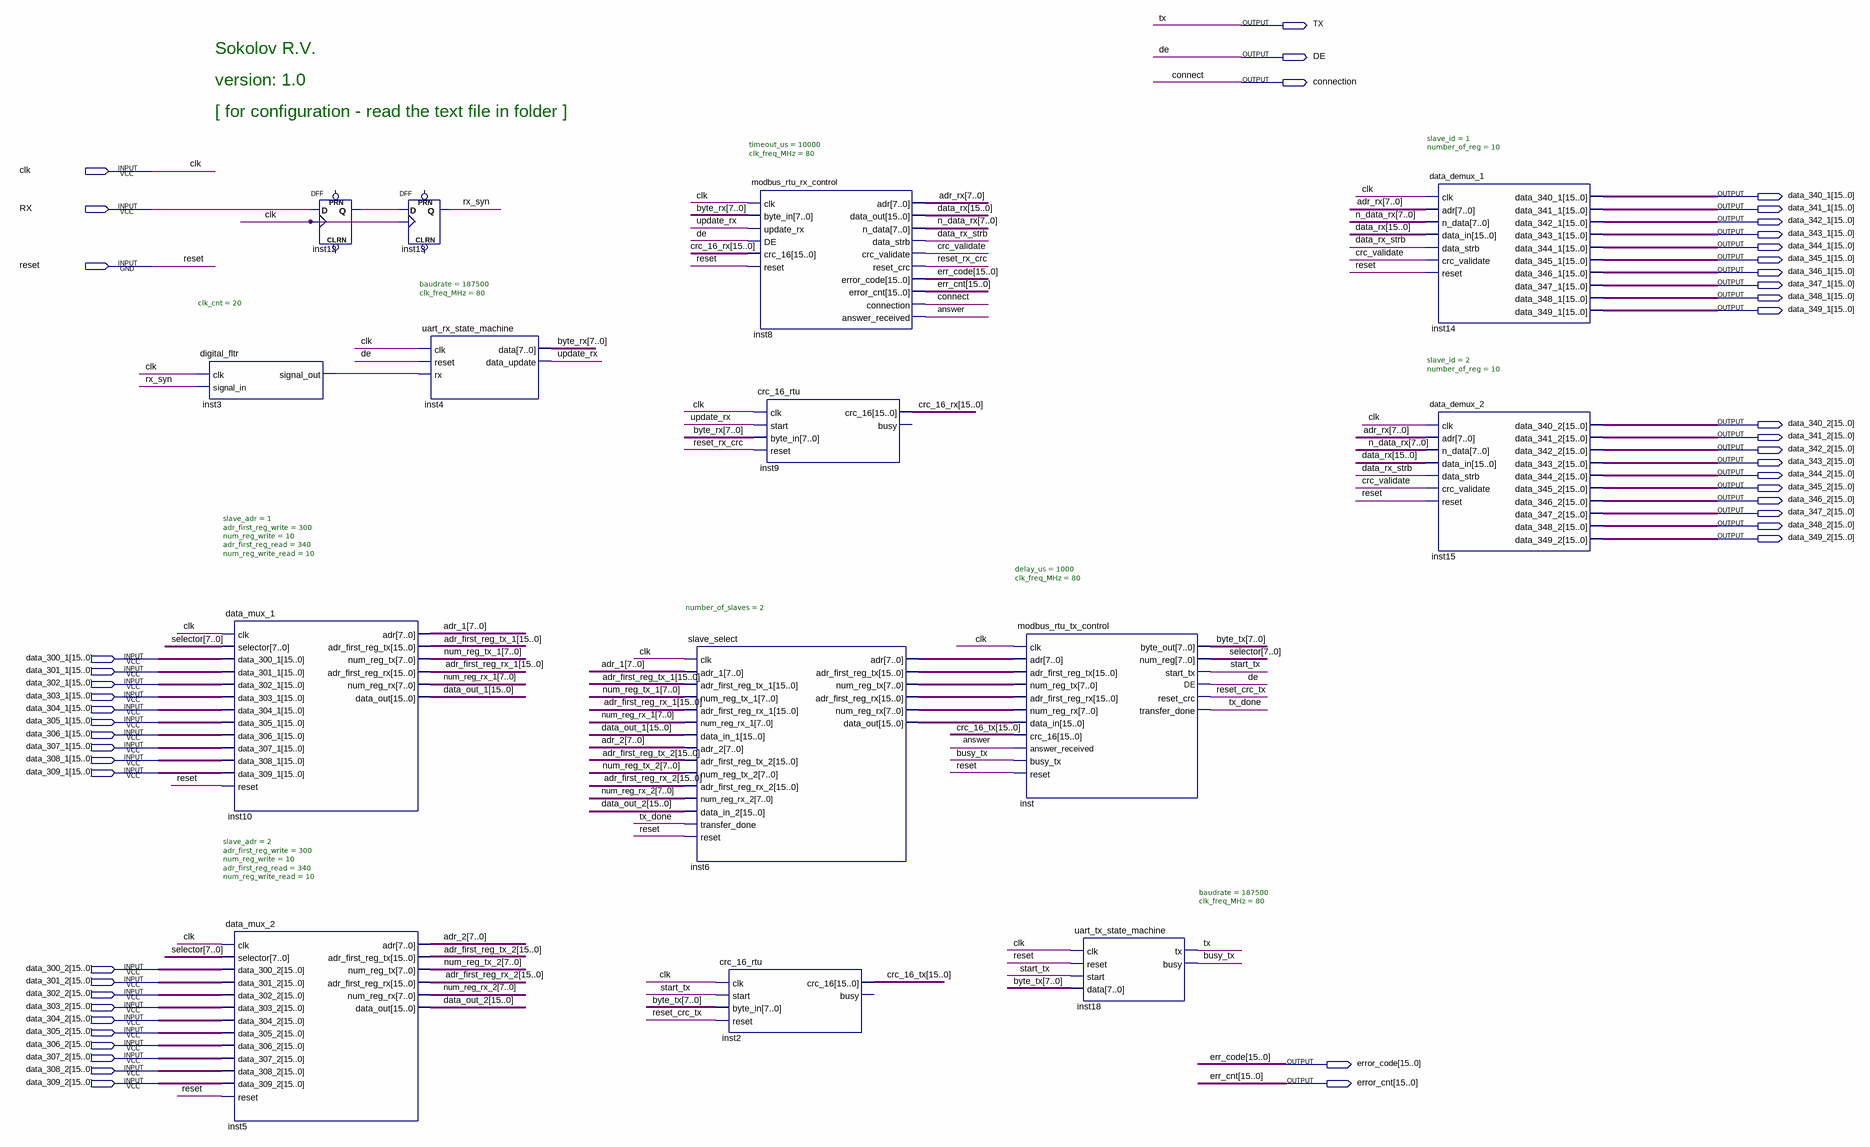
[diagram p0: schematic sheet]
// Quartus schematic Modbus_RTU_Master_v1.bdf as structural Verilog: 14 symbols, 48 pins
module Modbus_RTU_Master_v1 (
  input  clk,
  input  RX,
  input  reset,
  input  [15:0] data_300_1,
  input  [15:0] data_301_1,
  input  [15:0] data_302_1,
  input  [15:0] data_303_1,
  input  [15:0] data_304_1,
  input  [15:0] data_305_1,
  input  [15:0] data_306_1,
  input  [15:0] data_307_1,
  input  [15:0] data_308_1,
  input  [15:0] data_309_1,
  input  [15:0] data_300_2,
  input  [15:0] data_301_2,
  input  [15:0] data_302_2,
  input  [15:0] data_303_2,
  input  [15:0] data_304_2,
  input  [15:0] data_305_2,
  input  [15:0] data_306_2,
  input  [15:0] data_307_2,
  input  [15:0] data_308_2,
  input  [15:0] data_309_2,
  output TX,
  output DE,
  output connection,
  output [15:0] data_340_1,
  output [15:0] data_341_1,
  output [15:0] data_342_1,
  output [15:0] data_343_1,
  output [15:0] data_344_1,
  output [15:0] data_345_1,
  output [15:0] data_346_1,
  output [15:0] data_347_1,
  output [15:0] data_348_1,
  output [15:0] data_349_1,
  output [15:0] data_340_2,
  output [15:0] data_341_2,
  output [15:0] data_342_2,
  output [15:0] data_343_2,
  output [15:0] data_344_2,
  output [15:0] data_345_2,
  output [15:0] data_346_2,
  output [15:0] data_347_2,
  output [15:0] data_348_2,
  output [15:0] data_349_2,
  output [15:0] error_code,
  output [15:0] error_cnt
);

  wire answer, busy_tx, crc_validate, data_rx_strb, inst3_signal_out, inst12_q, reset_crc_tx, reset_rx_crc,
       rx_syn, start_tx, tx_done, update_rx;
  wire [7:0] adr_1, adr_2, adr_rx, byte_rx, byte_tx, inst6_adr, inst6_num_reg_rx, inst6_num_reg_tx,
       n_data_rx, num_reg_rx_1, num_reg_rx_2, num_reg_tx_1, num_reg_tx_2, selector;
  wire [15:0] adr_first_reg_rx_1, adr_first_reg_rx_2, adr_first_reg_tx_1, adr_first_reg_tx_2, crc_16_rx,
       crc_16_tx, data_out_1, data_out_2, data_rx, inst6_adr_first_reg_rx, inst6_adr_first_reg_tx,
       inst6_data_out;

  digital_fltr #(.clk_cnt(20)) inst3 (.clk(clk), .signal_in(rx_syn), .signal_out(inst3_signal_out));
  data_mux_1 #(.slave_adr(1), .adr_first_reg_write(300), .num_reg_write(10), .adr_first_reg_read(340), .num_reg_write_read(10)) inst10 (
    .clk(clk), .selector(selector), .data_300_1(data_300_1), .data_301_1(data_301_1),
    .data_302_1(data_302_1), .data_303_1(data_303_1), .data_304_1(data_304_1), .data_305_1(data_305_1),
    .data_306_1(data_306_1), .data_307_1(data_307_1), .data_308_1(data_308_1), .data_309_1(data_309_1),
    .reset(reset), .adr(adr_1), .adr_first_reg_tx(adr_first_reg_tx_1), .num_reg_tx(num_reg_tx_1),
    .adr_first_reg_rx(adr_first_reg_rx_1), .num_reg_rx(num_reg_rx_1), .data_out(data_out_1));
  data_mux_2 #(.slave_adr(2), .adr_first_reg_write(300), .num_reg_write(10), .adr_first_reg_read(340), .num_reg_write_read(10)) inst5 (
    .clk(clk), .selector(selector), .data_300_2(data_300_2), .data_301_2(data_301_2),
    .data_302_2(data_302_2), .data_303_2(data_303_2), .data_304_2(data_304_2), .data_305_2(data_305_2),
    .data_306_2(data_306_2), .data_307_2(data_307_2), .data_308_2(data_308_2), .data_309_2(data_309_2),
    .reset(reset), .adr(adr_2), .adr_first_reg_tx(adr_first_reg_tx_2), .num_reg_tx(num_reg_tx_2),
    .adr_first_reg_rx(adr_first_reg_rx_2), .num_reg_rx(num_reg_rx_2), .data_out(data_out_2));
  DFF inst12 (.CLK(clk), .D(RX), .Q(inst12_q));  // open: CLRN, PRN
  DFF inst13 (.CLK(clk), .D(inst12_q), .Q(rx_syn));  // open: CLRN, PRN
  uart_rx_state_machine #(.baudrate(187500), .clk_freq_MHz(80)) inst4 (
    .clk(clk), .reset(DE), .rx(inst3_signal_out), .data(byte_rx), .data_update(update_rx));
  slave_select #(.number_of_slaves(2)) inst6 (
    .clk(clk), .adr_1(adr_1), .adr_first_reg_tx_1(adr_first_reg_tx_1), .num_reg_tx_1(num_reg_tx_1),
    .adr_first_reg_rx_1(adr_first_reg_rx_1), .num_reg_rx_1(num_reg_rx_1), .data_in_1(data_out_1),
    .adr_2(adr_2), .adr_first_reg_tx_2(adr_first_reg_tx_2), .num_reg_tx_2(num_reg_tx_2),
    .adr_first_reg_rx_2(adr_first_reg_rx_2), .num_reg_rx_2(num_reg_rx_2), .data_in_2(data_out_2),
    .transfer_done(tx_done), .reset(reset), .adr(inst6_adr), .adr_first_reg_tx(inst6_adr_first_reg_tx),
    .num_reg_tx(inst6_num_reg_tx), .adr_first_reg_rx(inst6_adr_first_reg_rx), .num_reg_rx(inst6_num_reg_rx),
    .data_out(inst6_data_out));
  crc_16_rtu inst2 (
    .clk(clk), .start(start_tx), .byte_in(byte_tx), .reset(reset_crc_tx), .crc_16(crc_16_tx));  // open: busy
  modbus_rtu_rx_control #(.timeout_us(10000), .clk_freq_MHz(80)) inst8 (
    .clk(clk), .byte_in(byte_rx), .update_rx(update_rx), .DE(DE), .crc_16(crc_16_rx), .reset(reset),
    .adr(adr_rx), .data_out(data_rx), .n_data(n_data_rx), .data_strb(data_rx_strb),
    .crc_validate(crc_validate), .reset_crc(reset_rx_crc), .error_code(error_code), .error_cnt(error_cnt),
    .connection(connection), .answer_received(answer));
  crc_16_rtu inst9 (
    .clk(clk), .start(update_rx), .byte_in(byte_rx), .reset(reset_rx_crc), .crc_16(crc_16_rx));  // open: busy
  modbus_rtu_tx_control #(.delay_us(1000), .clk_freq_MHz(80)) inst (
    .clk(clk), .adr(inst6_adr), .adr_first_reg_tx(inst6_adr_first_reg_tx), .num_reg_tx(inst6_num_reg_tx),
    .adr_first_reg_rx(inst6_adr_first_reg_rx), .num_reg_rx(inst6_num_reg_rx), .data_in(inst6_data_out),
    .crc_16(crc_16_tx), .answer_received(answer), .busy_tx(busy_tx), .reset(reset), .byte_out(byte_tx),
    .num_reg(selector), .start_tx(start_tx), .DE(DE), .reset_crc(reset_crc_tx), .transfer_done(tx_done));
  uart_tx_state_machine #(.baudrate(187500), .clk_freq_MHz(80)) inst18 (
    .clk(clk), .reset(reset), .start(start_tx), .data(byte_tx), .tx(TX), .busy(busy_tx));
  data_demux_1 #(.slave_id(1), .number_of_reg(10)) inst14 (
    .clk(clk), .adr(adr_rx), .n_data(n_data_rx), .data_in(data_rx), .data_strb(data_rx_strb),
    .crc_validate(crc_validate), .reset(reset), .data_340_1(data_340_1), .data_341_1(data_341_1),
    .data_342_1(data_342_1), .data_343_1(data_343_1), .data_344_1(data_344_1), .data_345_1(data_345_1),
    .data_346_1(data_346_1), .data_347_1(data_347_1), .data_348_1(data_348_1), .data_349_1(data_349_1));
  data_demux_2 #(.slave_id(2), .number_of_reg(10)) inst15 (
    .clk(clk), .adr(adr_rx), .n_data(n_data_rx), .data_in(data_rx), .data_strb(data_rx_strb),
    .crc_validate(crc_validate), .reset(reset), .data_340_2(data_340_2), .data_341_2(data_341_2),
    .data_342_2(data_342_2), .data_343_2(data_343_2), .data_344_2(data_344_2), .data_345_2(data_345_2),
    .data_346_2(data_346_2), .data_347_2(data_347_2), .data_348_2(data_348_2), .data_349_2(data_349_2));

  // Other names for the same wires on the sheet: connect = connection; err_cnt[15:0] = error_cnt;
  //   err_code[15:0] = error_code

  // Notes on the sheet:
  //   Sokolov R.V.
  //   version: 1.0
  //   [ for configuration - read the text file in folder ]
endmodule
